# EAGLE design Sample End Effector (EAGLE 7.0.0)

## Sheet 1 of 2
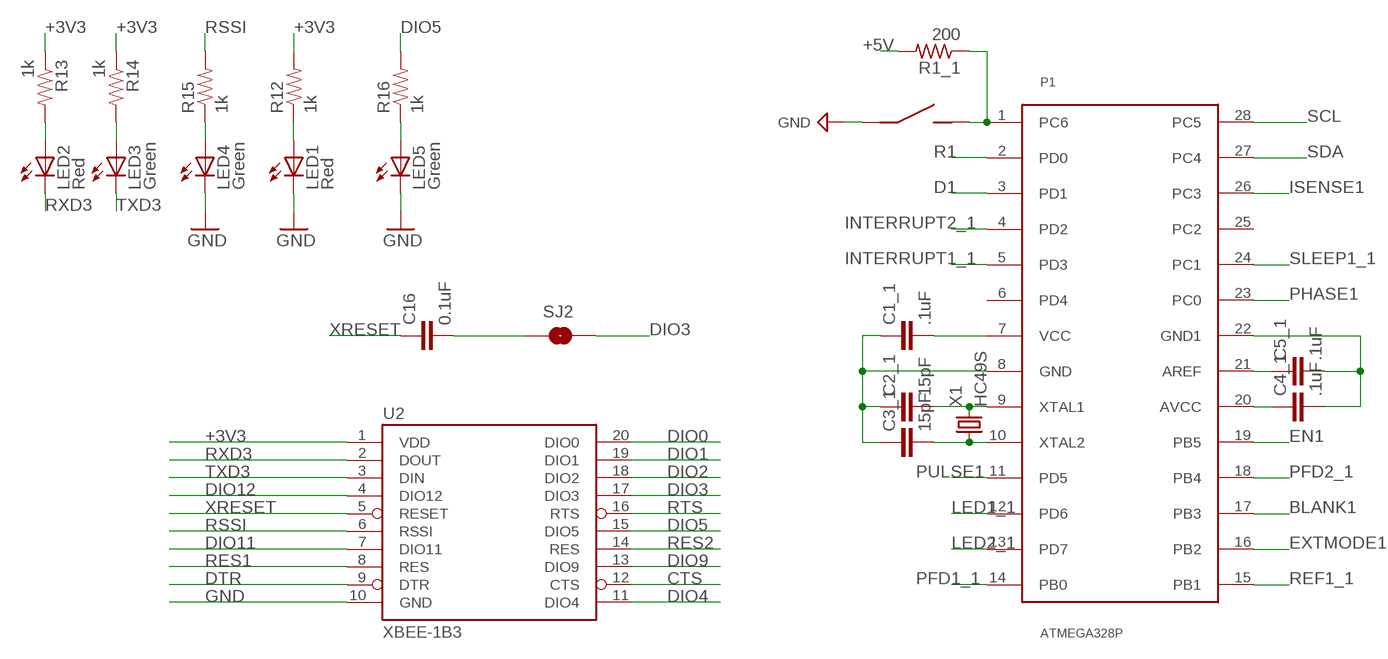
[diagram p0: schematic, sheet 1]

### Parts
C1_1  .1uF  C_CAP_0805  [C_0805]
C2_1  15pF  C_CAP_0805  [C_0805]
C3_1  15pF  C_CAP_0805  [C_0805]
C4_1  .1uF  C_CAP_0805  [C_0805]
C5_1  .1uF  C_CAP_0805  [C_0805]
C16  0.1uF  0.1UF-25V(+80/-20%)(0603)  [0603-CAP]
LED1  Red  LED-RED0603  [LED-0603]
LED2  Red  LED-RED0603  [LED-0603]
LED3  Green  LED-GREEN0603  [LED-0603]
LED4  Green  LED-GREEN0603  [LED-0603]
LED5  Green  LED-GREEN0603  [LED-0603]
P1  ATMEGA328P  Q_ATMEGA328P  [DIP28]
R1_1  200  R_RES_0805  [R_0805]
R12  1k  1KOHM1/10W1%(0603)  [0603-RES]
R13  1k  1KOHM1/10W1%(0603)  [0603-RES]
R14  1k  1KOHM1/10W1%(0603)  [0603-RES]
R15  1k  1KOHM1/10W1%(0603)  [0603-RES]
R16  1k  1KOHM1/10W1%(0603)  [0603-RES]
S1  J_MC32857  [J_TOGGLE]
SJ2  SOLDERJUMPERTRACE  [SJ_2S-TRACE]
U2  XBEE-1B3  [XBEE-SMD]
X1  HC49S  X_HC49SCRYSTAL  [HC-49]

### Nets
+3V3: R12.2 R13.1 R14.1 U2.1(VDD) ; also sheet 2
+5V: C1_1.2 C4_1.1 P1.7(VCC) P1.20(AVCC) R1_1.2 ; also sheet 2
BLANK1: P1.17(PB3)
CTS: U2.12(CTS)
D1: P1.3(PD1)
DIO0: U2.20(DIO0)
DIO1: U2.19(DIO1)
DIO2: U2.18(DIO2)
DIO3: SJ2.2 U2.17(DIO3)
DIO4: U2.11(DIO4)
DIO5: R16.2 U2.15(DIO5)
DIO9: U2.13(DIO9)
DIO11: U2.7(DIO11)
DIO12: U2.4(DIO12)
DTR: U2.9(DTR)
EN1: P1.19(PB5)
EXTMODE1: P1.16(PB2)
GND: C1_1.1 C2_1.1 C3_1.1 C4_1.2 C5_1.2 LED1.C LED4.C LED5.C P1.8(GND) P1.22(GND1) S1.P$1 U2.10(GND) ; supply symbol labelled SUP_GND ; also sheet 2
INTERRUPT1_1: P1.5(PD3)
INTERRUPT2_1: P1.4(PD2)
ISENSE1: P1.26(PC3)
LED1_1: P1.12(PD6)
LED2_1: P1.13(PD7)
N$1: C3_1.2 P1.10(XTAL2) X1.P$1
N$4: LED2.A R13.2
N$6: LED3.A R14.2
N$7: LED4.A R15.1
N$11: C16.2 SJ2.1
N$12: C2_1.2 P1.9(XTAL1) X1.P$2
N$14: C5_1.1 P1.21(AREF)
N$15: P1.1(PC6) R1_1.1 S1.P$2
N$38: LED1.A R12.1
N$139: LED5.A R16.1
PFD1_1: P1.14(PB0)
PFD2_1: P1.18(PB4)
PHASE1: P1.23(PC0)
PULSE1: P1.11(PD5)
R1: P1.2(PD0)
REF1_1: P1.15(PB1)
RES1: U2.8(RES)
RES2: U2.14(RES)
RSSI: R15.2 U2.6(RSSI)
RTS: U2.16(RTS)
RXD3: LED2.C U2.2(DOUT)
SCL: P1.28(PC5)
SDA: P1.27(PC4)
SLEEP1_1: P1.24(PC1)
TXD3: LED3.C U2.3(DIN)
XRESET: C16.1 U2.5(RESET)
Unconnected: P1.6(PD4) P1.25(PC2)

## Sheet 2 of 2
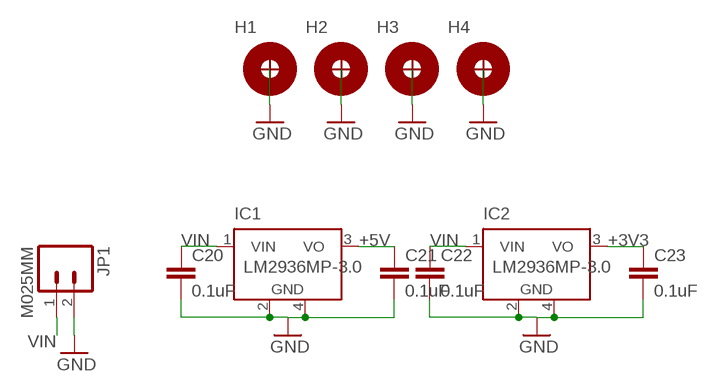
[diagram p1: schematic, sheet 2]

### Parts
C20  0.1uF  0.1UF-25V(+80/-20%)(0603)  [0603-CAP]
C21  0.1uF  0.1UF-25V(+80/-20%)(0603)  [0603-CAP]
C22  0.1uF  0.1UF-25V(+80/-20%)(0603)  [0603-CAP]
C23  0.1uF  0.1UF-25V(+80/-20%)(0603)  [0603-CAP]
H1  H_MNTHOLE_#4  [H_MNTHOLE_#4]
H2  H_MNTHOLE_#4  [H_MNTHOLE_#4]
H3  H_MNTHOLE_#4  [H_MNTHOLE_#4]
H4  H_MNTHOLE_#4  [H_MNTHOLE_#4]
IC1  LM2936MP-3.0  [SOT223]
IC2  LM2936MP-3.0  [SOT223]
JP1  M025MM  [SCREWTERMINAL-5MM-2]

### Nets
+3V3: C23.1 IC2.3(VO) ; also sheet 1
+5V: C21.1 IC1.3(VO) ; also sheet 1
GND: C20.2 C21.2 C22.2 C23.2 H1.1 H2.1 H3.1 H4.1 IC1.2(GND) IC1.4(GND) IC2.2(GND) IC2.4(GND) JP1.2 ; also sheet 1
VIN: C20.1 C22.1 IC1.1(VIN) IC2.1(VIN) JP1.1

## Library data of the parts
C1_1 C2_1 C3_1 C4_1 C5_1 = Lib_Passive:C_CAP
C16 C20-C23 = SparkFun-Capacitors:0.1UF-25V(+80/-20%)(0603): CAP-00810 Ceramic Standard decoupling cap; PROD_ID: CAP-00810
H1-H4 = Lib_TH:H_MNTHOLE
IC1 IC2 = national-semiconductor:LM2936MP?*: Ultra-Low Quiescent Current LDO Voltage Regulator Source: Data sheet <http://www.national.com/ds/LM/LM2936.pdf>; MF: NATIONAL SEMICONDUCTOR; MPN: LM2936MP-3.0/NOPB; OC_FARNELL: 1496125; OC_NEWARK: 41K4522
JP1 = SparkFun-Connectors:M02: Standard 2-pin 0.1" header. Use with - straight break away headers ( PRT-00116) - right angle break away headers (PRT-00553) - swiss pins (PRT-00743) - machine pins (PRT-00117) - female headers (PRT-00115) Molex polarized connector foot print use with: PRT-08233 with associated crimp pins and housings. 2.54_SCREWTERM for use with PRT-10571. 3.5mm Screw Terminal footprints for PRT-08084 5mm Screw Terminal footprints for use with PRT-08433
LED1 LED2 = SparkFun-LED:LED-RED: Assorted Red LEDs LilyPad 1206- DIO-09912 1206- DIO-00809 0603- DIO-00819; PROD_ID: DIO-00819; VALUE: RED
LED3-LED5 = SparkFun-LED:LED-GREEN: Various green LEDs Green LEDs used in SFE Production 0603- DIO-00821 LARGE- DIO-00862 LILYPAD- DIO-09910; PROD_ID: DIO-00821; VALUE: GREEN
P1 = PCB0M1:Q_ATMEGA328P: ATMEGA 328P in 28PIN PDIP package
R1_1 = Lib_Passive:R_RES
R12-R16 = SparkFun-Resistors:1KOHM1/10W1%(0603): RES-07856; PROD_ID: RES-07856; VALUE: 1K
S1 = PCB0M1:J_MC32857: SWITCH, TACTILE, SPST-NO, 50mA, THD
SJ2 = SparkFun:SOLDERJUMPER: Solder Jumper Standard SMD solder jumper. Used to automate production. Two varients : Normally Open and Normally Closed are the same, but have different paste layers. NC will have a large amount of paste and should jumper during reflow.
U2 = SparkFun:XBEE-1
X1 = PCB0M1:X_HC49SCRYSTAL: CRYSTAL METAL CAN, 16MHZ, 18PF, HC-49/US

## Board
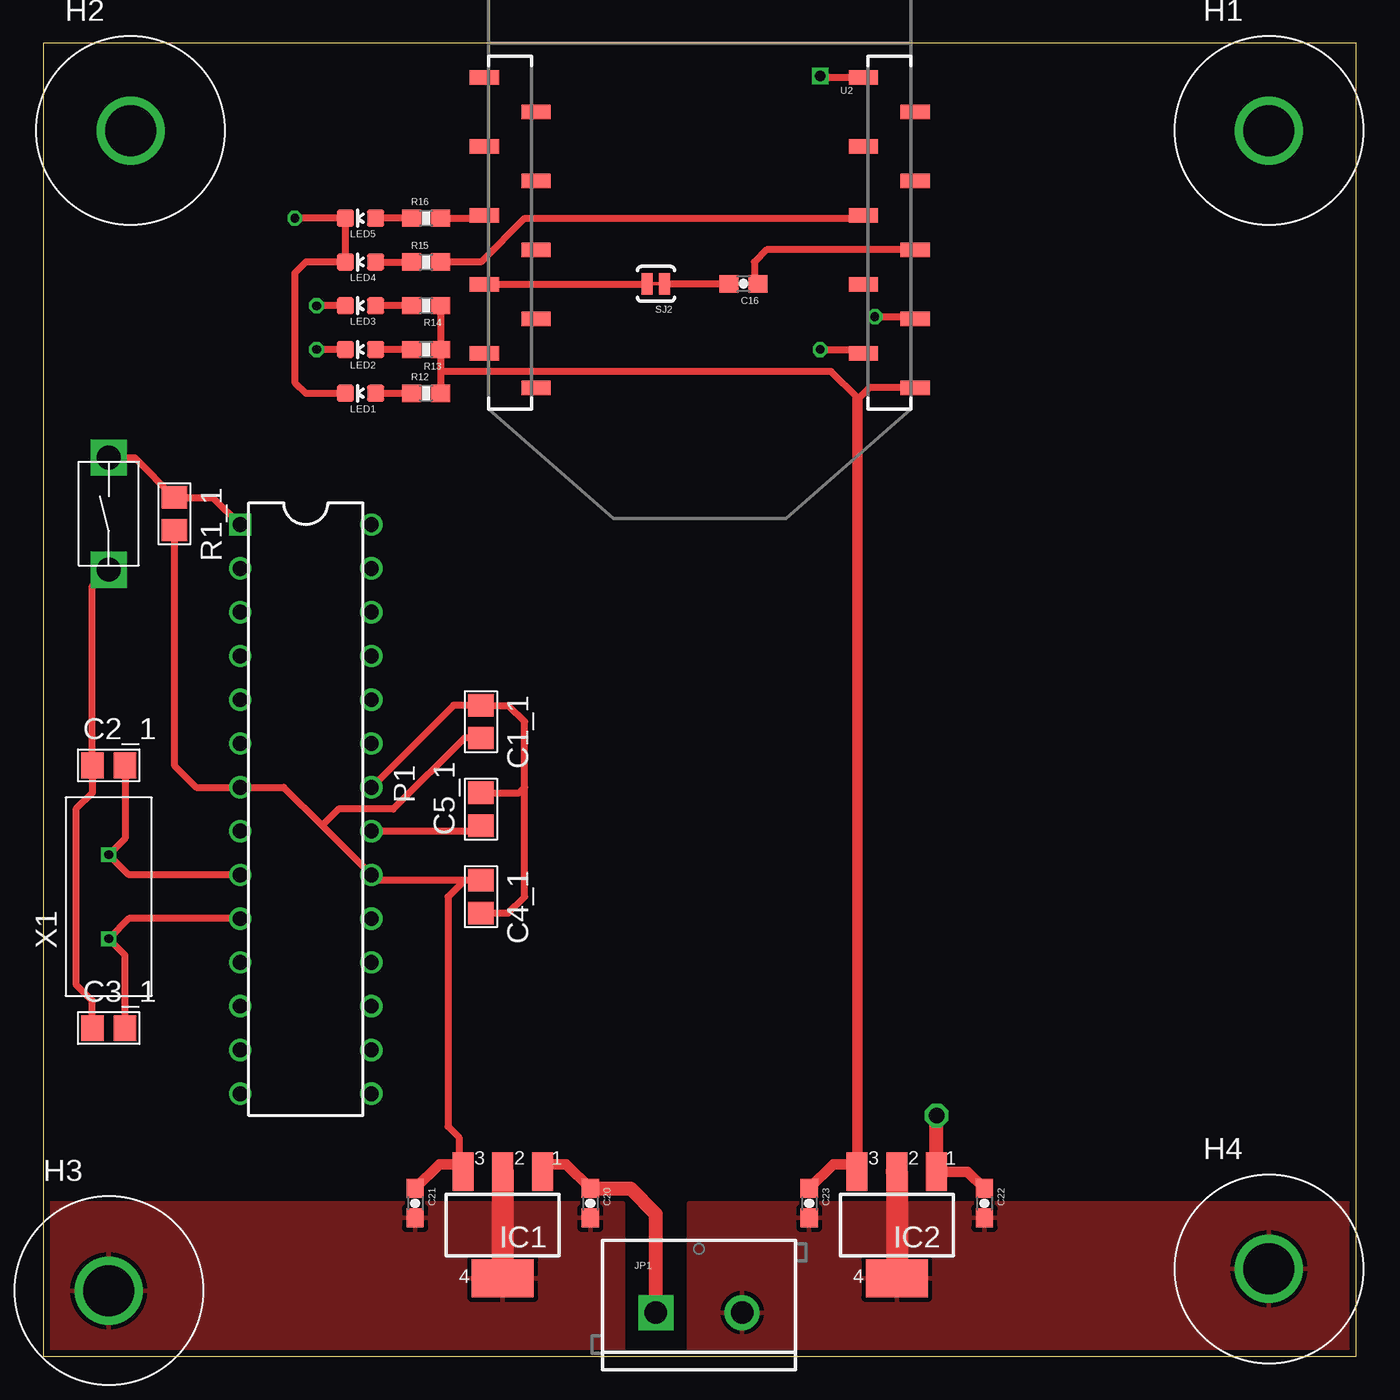
[diagram p2: board, top side]
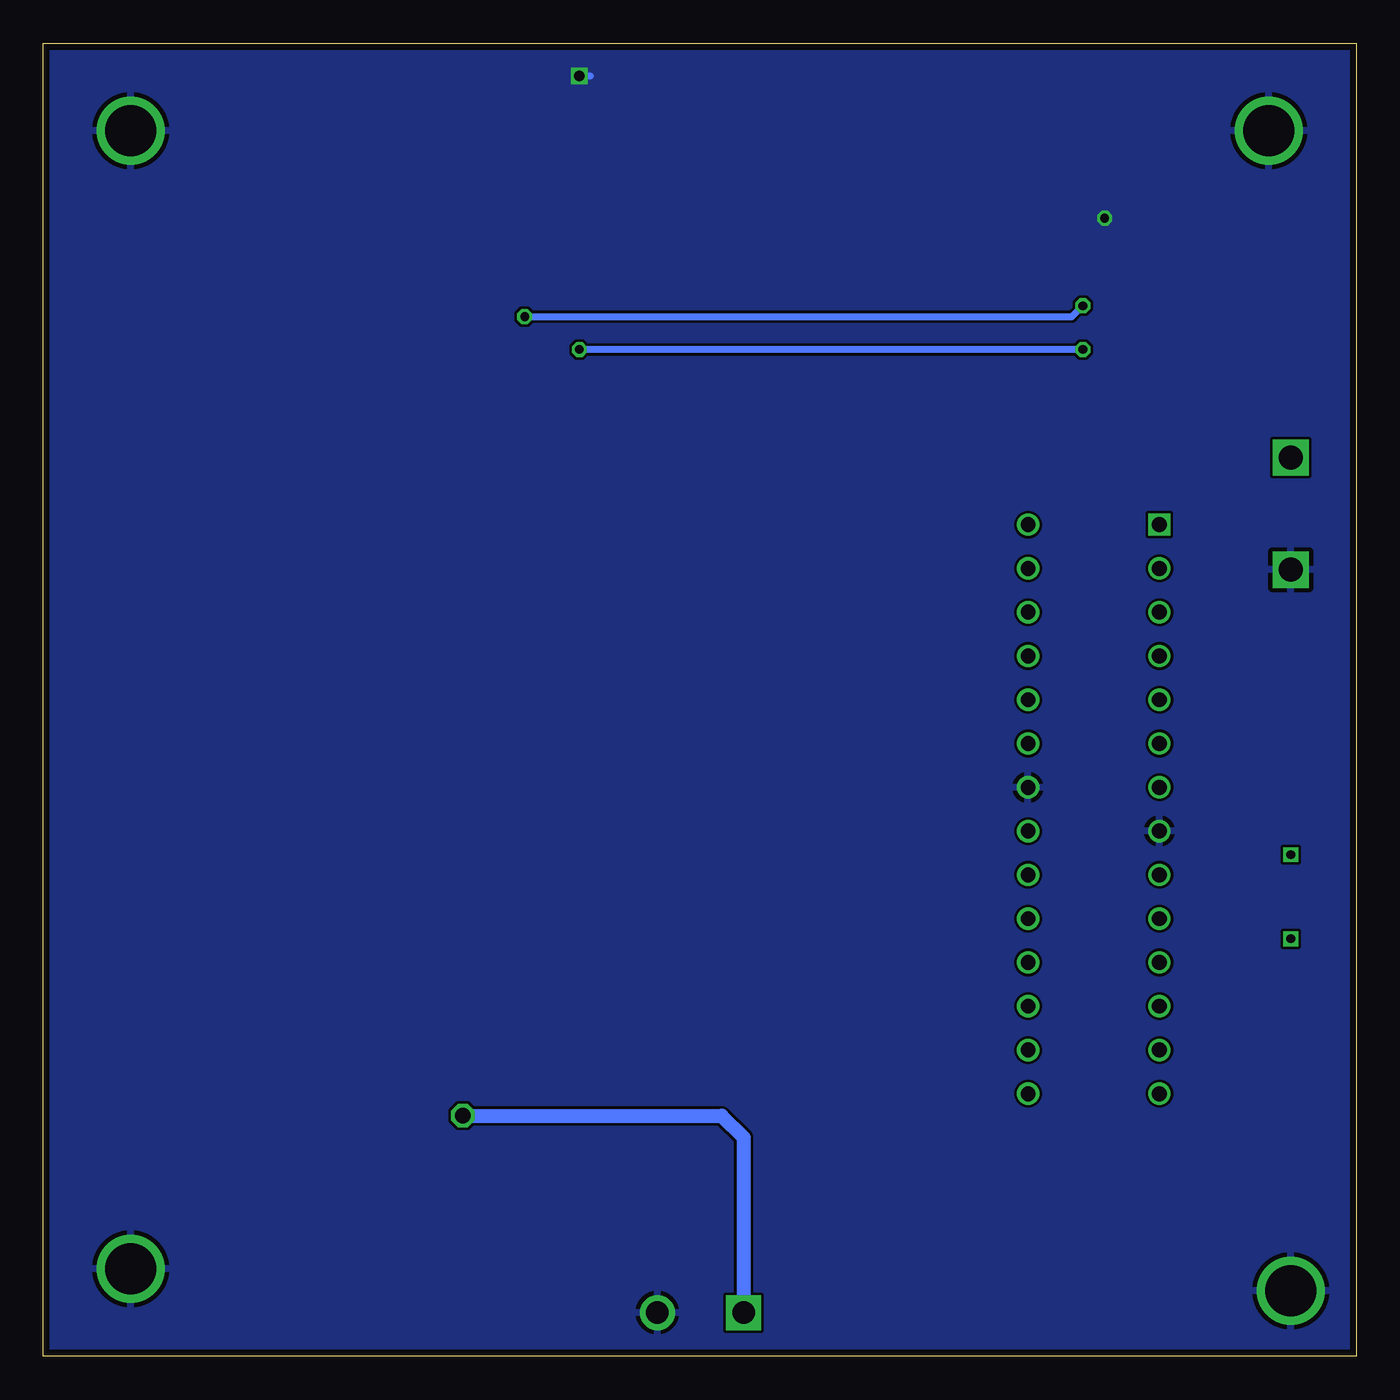
[diagram p3: board, bottom side, seen from below]

Size 76.2 x 76.2 mm. Coordinates in mm from the lower left corner, seen from the top.
Outline: 0,0 76.2,0 76.2,76.2 0,76.2 0,0
Copper layers (1*16): Top 0.0356mm / dielectric 1.5011mm / Bottom 0.0356mm
Design rules "LaenPCBOrder": minimum track width 6mil, minimum drill 13mil, track to track 6mil, track to pad 6mil, pad to pad 6mil, via to via 6mil, smd to smd 6mil, copper to edge 15mil, drill to drill 6mil, minimum pad ring 7mil, minimum via ring 7mil, stop-mask expansion 3mil, vias tented up to drill 0mil, thermal gap 10mil

### Footprints (pad centres in the part's own frame; a part is rotated, then mirrored left to right if it is on the bottom)
C_0805 = smd 1.3 x 1.5: 1 -0.95,0; 2 0.95,0
0603-CAP = smd 1.1 x 1: 1 -0.85,0; 2 0.85,0
H_MNTHOLE_#4 = drill 2.946: 1 0,0
SOT223 = smd 1.219 x 2.235: 1 -2.311,-3.099; 2 0,-3.099; 3 2.311,-3.099 | smd 3.6 x 2.2: 4 0,3.099
SCREWTERMINAL-5MM-2 = drill 1.3 pad 2.032 square: 1 0,0 | drill 1.3 pad 2.032: 2 5,0
LED-0603 = smd 1 x 1: A 0,-0.877; C 0,0.877
DIP28 = drill 0.864 square: 1 -16.51,-3.81 | drill 0.864: 2 -13.97,-3.81; 3 -11.43,-3.81; 4 -8.89,-3.81; 5 -6.35,-3.81; 6 -3.81,-3.81; 7 -1.27,-3.81; 8 1.27,-3.81; 9 3.81,-3.81; 10 6.35,-3.81; 11 8.89,-3.81; 12 11.43,-3.81; 13 13.97,-3.81; 14 16.51,-3.81; 15 16.51,3.81; 16 13.97,3.81; 17 11.43,3.81; 18 8.89,3.81; 19 6.35,3.81; 20 3.81,3.81; 21 1.27,3.81; 22 -1.27,3.81; 23 -3.81,3.81; 24 -6.35,3.81; 25 -8.89,3.81; 26 -11.43,3.81; 27 -13.97,3.81; 28 -16.51,3.81
R_0805 = smd 1.3 x 1.5: 1 -0.95,0; 2 0.95,0
0603-RES = smd 1.1 x 1: 1 -0.85,0; 2 0.85,0
J_TOGGLE = drill 1.4 square: P$1 -3.25,0; P$2 3.25,0
SJ_2S-TRACE = smd 0.635 x 1.27: 1 -0.508,0; 2 0.508,0
XBEE-SMD = smd 1.7 x 0.85: 1 -12.5,20; 2 -9.5,18; 3 -12.5,16; 4 -9.5,14; 5 -12.5,12; 6 -9.5,10; 7 -12.5,8; 8 -9.5,6; 9 -12.5,4; 10 -9.5,2; 11 12.5,2; 12 9.5,4; 13 12.5,6; 14 9.5,8; 15 12.5,10; 16 9.5,12; 17 12.5,14; 18 9.5,16; 19 12.5,18; 20 9.5,20
HC-49 = drill 0.5 square: P$1 -2.44,0; P$2 2.44,0

### Placement (x,y rotation side)
C1_1  25.4,36.83 270 top
C2_1  3.81,34.29 0 top
C3_1  3.81,19.05 0 top
C4_1  25.4,26.67 270 top
C5_1  25.4,31.75 90 top
C16  40.64,62.23 180 top
C20  31.75,8.89 270 top
C21  21.59,8.89 270 top
C22  54.61,8.89 270 top
C23  44.45,8.89 270 top
H1  71.12,71.12 0 top
H2  5.08,71.12 0 top
H3  3.81,3.81 0 top
H4  71.12,5.08 0 top
IC1  26.67,7.62 180 top
IC2  49.53,7.62 180 top
JP1  35.56,2.54 0 top
LED1  18.41,55.88 90 top
LED2  18.41,58.42 90 top
LED3  18.41,60.96 90 top
LED4  18.41,63.5 90 top
LED5  18.41,66.04 90 top
P1  15.24,31.75 270 top
R1_1  7.62,48.9 270 top
R12  22.23,55.88 0 top
R13  22.23,58.42 180 top
R14  22.23,60.96 180 top
R15  22.23,63.5 0 top
R16  22.23,66.04 0 top
S1  3.81,48.9 90 top
SJ2  35.56,62.23 180 top
U2  38.1,76.2 180 top
X1  3.81,26.67 90 top

### Tracks (layer width: path | path; a pad name or v marks a point on that pad's centre or on a via)
+3V3
  Top 0.406: R14.1 R13.1 23.07,57.15 | 23.07,57.15 23.07,56.3 22.86,55.88 R12.2 | U2.1 47.95,56.2 47.25,55.51 47.25,55.62 45.72,57.15 23.07,57.15
  Top 0.61: C23.1 45.86,11.15 46.79,11.15 IC2.3 47.25,10.75 47.25,55.51
+5V
  Top 0.406: 16.19,30.8 13.97,33.02 P1.7 8.89,33.02 7.62,34.29 R1_1.2 | 16.19,30.8 P1.20 19.37,27.62 C4_1.1 24.45,27.62 23.5,26.67 23.5,13.34 24.13,12.7 24.13,11.35 23.93,11.15 | C1_1.2 24.45,35.88 20.32,31.75 17.14,31.75 16.19,30.8
  Top 0.61: C21.1 23,11.15 23.93,11.15 IC1.3
DIO3
  Top 0.406: U2.17 35.05,62.2 SJ2.2
DIO5
  Top 0.406: R16.2 25.44,66.04 U2.15
GND  (via drill 0.5, 0.6)
  Top 0.406: LED1.C 15.24,55.88 14.61,56.52 14.61,62.87 15.24,63.5 LED4.C LED5.C v14.61,66.04 | U2.10 45.18,74.2 v45.09,74.3 | C3_1.1 2.86,20.64 1.91,21.59 1.91,31.75 2.86,32.7 C2_1.1 2.86,44.7 S1.P$1 | P1.22 23.81,37.78 C1_1.1 26.99,37.78 27.94,36.83 27.94,33.02 | C4_1.2 26.99,25.72 27.94,26.67 27.94,33.02 | C5_1.2 27.62,32.7 27.94,33.02
  Top 1.27: IC1.2 26.67,5.08 | IC2.2 IC2.4
  Bottom 0.406: v45.09,74.3 44.45,74.3
  pour Bottom: 0,76.2 0,0 76.2,0 76.2,76.2
  pour Top: 76.2,8.89 37.47,8.89 37.47,0 76.2,0
  pour Top: 33.66,8.89 0,8.89 0,0 33.66,0
N$1
  Top 0.406: C3_1.2 4.76,23.28 X1.P$1 4.98,25.4 P1.10
N$4
  Top 0.406: R13.2 LED2.A
N$6
  Top 0.406: R14.2 LED3.A
N$7
  Top 0.406: R15.1 LED4.A 19.05,63.5
N$11
  Top 0.406: SJ2.1 C16.2
N$12
  Top 0.406: C2_1.2 4.76,30.06 X1.P$2 4.98,27.94 P1.9
N$14
  Top 0.406: P1.21 25.08,30.48 C5_1.1
N$15
  Top 0.406: S1.P$2 5.32,52.15 R1_1.1 9.85,49.84 P1.1
N$38
  Top 0.406: LED1.A R12.1
N$139
  Top 0.406: R16.1 LED5.A
RSSI
  Top 0.406: U2.6 47.44,66.04 27.94,66.04 25.4,63.5 R15.2
RXD3  (via drill 0.5)
  Top 0.406: LED2.C v15.88,58.42 | v45.09,58.42 47.38,58.42 U2.2
  Bottom 0.406: v15.88,58.42 v45.09,58.42
TXD3  (via drill 0.5)
  Top 0.406: LED3.C v15.88,60.96 | v48.26,60.33 50.48,60.33 U2.3
  Bottom 0.406: v48.26,60.33 16.51,60.33 v15.88,60.96
VIN  (via drill 0.9)
  Top 0.61: C20.1 30.34,11.15 29.41,11.15 IC1.1 | IC2.1 53.63,10.72 C22.1
  Top 0.813: JP1.1 35.56,8.26 34.08,9.74 C20.1 | IC2.1 v51.84,13.97
  Bottom 0.813: v51.84,13.97 36.83,13.97 35.56,12.7 JP1.1
XRESET
  Top 0.406: U2.5 41.98,64.2 41.27,63.5 41.27,62.45 C16.1